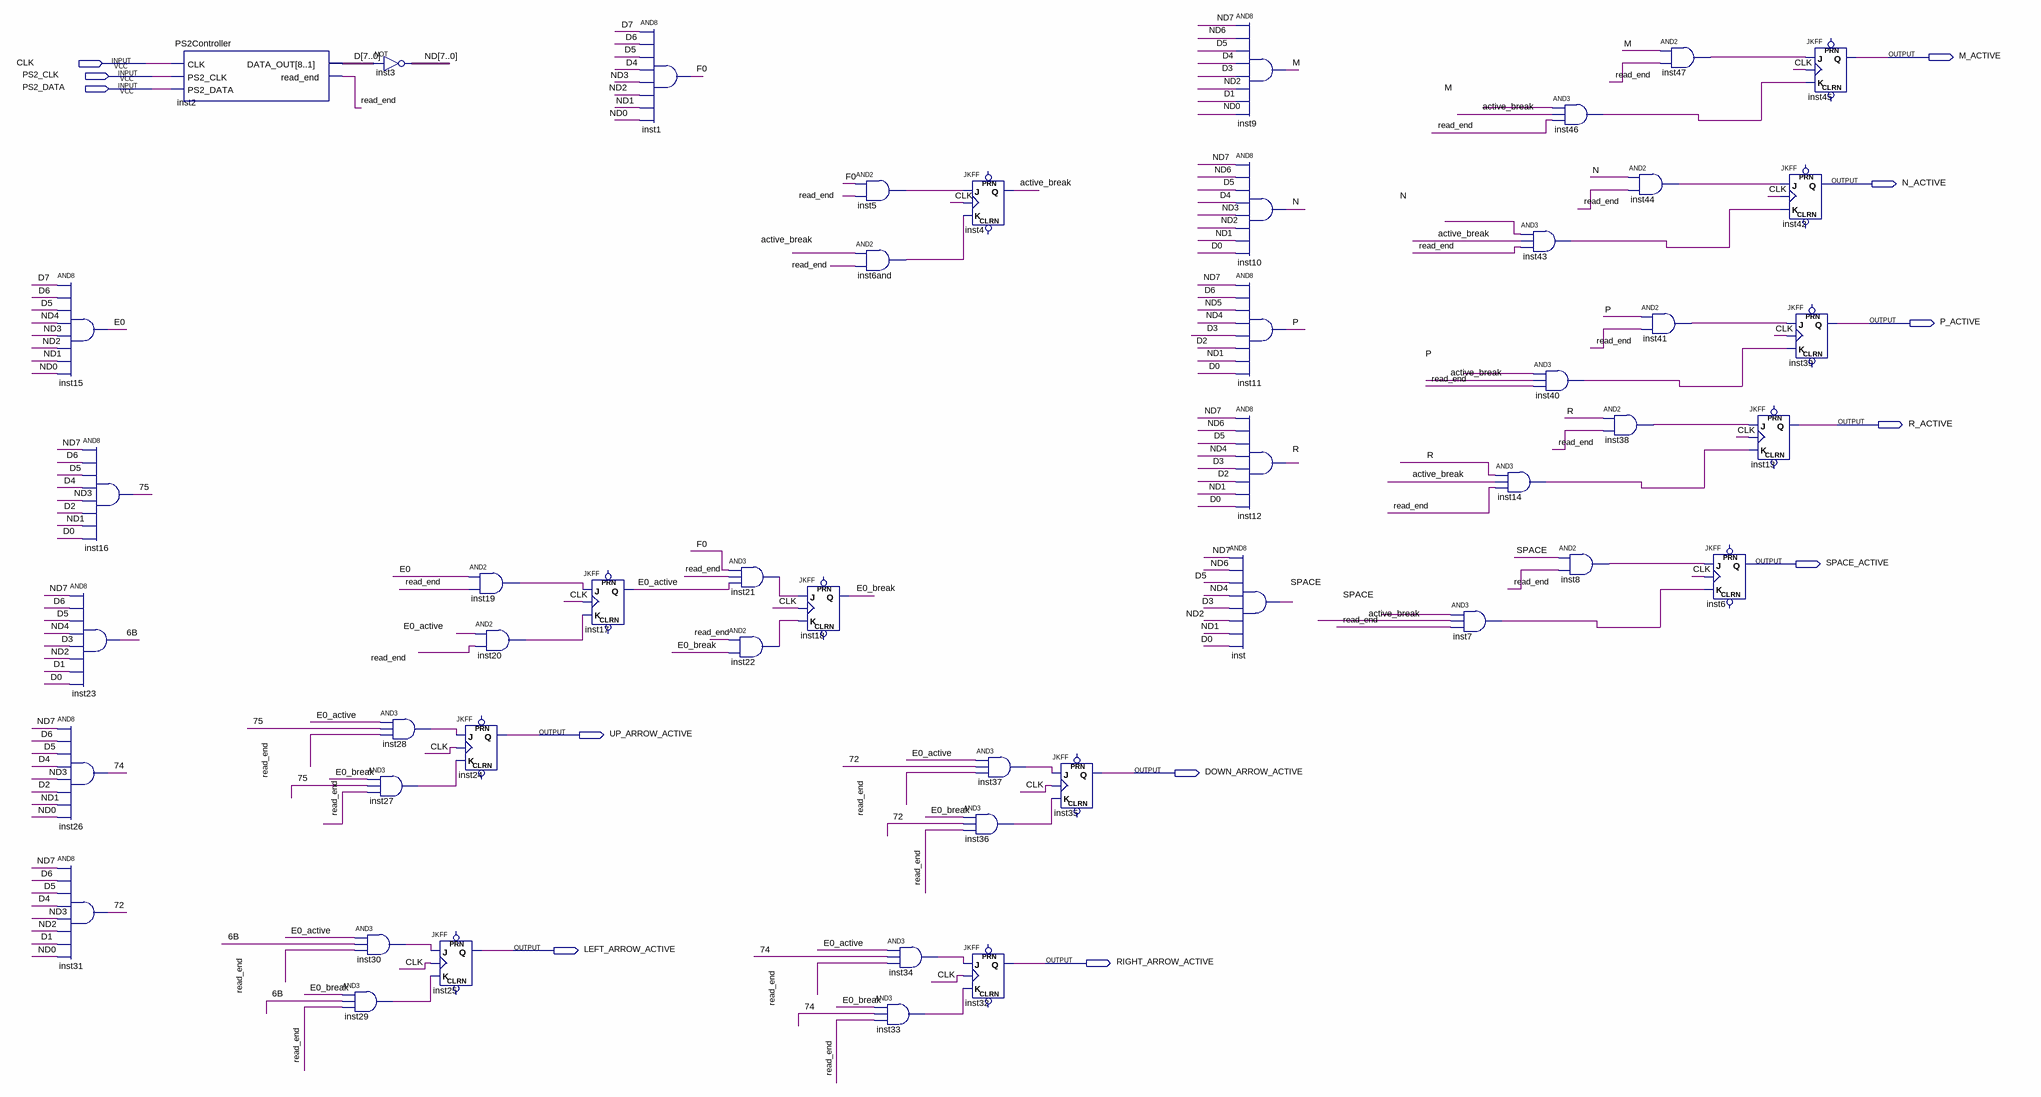
[diagram p0: schematic sheet]
// Quartus schematic KeyDetector.bdf as structural Verilog: 49 symbols, 12 pins
module KeyDetector (
  input  CLK,
  input  PS2_CLK,
  input  PS2_DATA,
  output M_ACTIVE,
  output N_ACTIVE,
  output P_ACTIVE,
  output R_ACTIVE,
  output SPACE_ACTIVE,
  output UP_ARROW_ACTIVE,
  output DOWN_ARROW_ACTIVE,
  output LEFT_ARROW_ACTIVE,
  output RIGHT_ARROW_ACTIVE
);

  wire \6B , \72 , \74 , \75 , active_break, E0, E0_active, E0_break, F0, inst5_out, inst6and_out, inst7_out,
       inst8_out, inst14_out, inst19_out, inst20_out, inst21_out, inst22_out, inst27_out, inst28_out,
       inst29_out, inst30_out, inst33_out, inst34_out, inst36_out, inst37_out, inst38_out, inst40_out,
       inst41_out, inst43_out, inst44_out, inst46_out, inst47_out, M, N, P, R, read_end, SPACE;
  wire [7:0] D, ND;

  and inst15 (E0, D[7], D[6], D[5], ND[4], ND[3], ND[2], ND[1], ND[0]);
  and inst23 (\6B , ND[7], D[6], D[5], ND[4], D[3], ND[2], D[1], D[0]);
  and inst26 (\74 , ND[7], D[6], D[5], D[4], ND[3], D[2], ND[1], ND[0]);
  and inst31 (\72 , ND[7], D[6], D[5], D[4], ND[3], ND[2], D[1], ND[0]);
  and inst16 (\75 , ND[7], D[6], D[5], D[4], ND[3], D[2], ND[1], D[0]);
  PS2Controller inst2 (.CLK(CLK), .PS2_CLK(PS2_CLK), .PS2_DATA(PS2_DATA), .DATA_OUT(D), .read_end(read_end));
  assign ND = ~D;  // NOT inst3, 8 bits wide
  and inst27 (inst27_out, E0_break, \75 , read_end);
  and inst30 (inst30_out, E0_active, \6B , read_end);
  and inst29 (inst29_out, E0_break, \6B , read_end);
  and inst28 (inst28_out, E0_active, \75 , read_end);
  and inst19 (inst19_out, E0, read_end);
  and inst20 (inst20_out, E0_active, read_end);
  JKFF inst24 (.K(inst27_out), .J(inst28_out), .CLK(CLK), .Q(UP_ARROW_ACTIVE));  // open: PRN, CLRN
  JKFF inst25 (.K(inst29_out), .J(inst30_out), .CLK(CLK), .Q(LEFT_ARROW_ACTIVE));  // open: PRN, CLRN
  JKFF inst17 (.K(inst20_out), .J(inst19_out), .CLK(CLK), .Q(E0_active));  // open: PRN, CLRN
  and inst1 (F0, D[7], D[6], D[5], D[4], ND[3], ND[2], ND[1], ND[0]);
  and inst21 (inst21_out, F0, read_end, E0_active);
  and inst22 (inst22_out, read_end, E0_break);
  JKFF inst18 (.K(inst22_out), .J(inst21_out), .CLK(CLK), .Q(E0_break));  // open: PRN, CLRN
  and inst5 (inst5_out, F0, read_end);
  and inst6and (inst6and_out, active_break, read_end);
  and inst33 (inst33_out, E0_break, \74 , read_end);
  and inst34 (inst34_out, E0_active, \74 , read_end);
  JKFF inst4 (.K(inst6and_out), .J(inst5_out), .CLK(CLK), .Q(active_break));  // open: PRN, CLRN
  and inst37 (inst37_out, E0_active, \72 , read_end);
  and inst36 (inst36_out, E0_break, \72 , read_end);
  JKFF inst32 (.K(inst33_out), .J(inst34_out), .CLK(CLK), .Q(RIGHT_ARROW_ACTIVE));  // open: PRN, CLRN
  JKFF inst35 (.K(inst36_out), .J(inst37_out), .CLK(CLK), .Q(DOWN_ARROW_ACTIVE));  // open: PRN, CLRN
  and inst9 (M, ND[7], ND[6], D[5], D[4], D[3], ND[2], D[1], ND[0]);
  and inst10 (N, ND[7], ND[6], D[5], D[4], ND[3], ND[2], ND[1], D[0]);
  and inst11 (P, ND[7], D[6], ND[5], ND[4], D[3], D[2], ND[1], D[0]);
  and inst12 (R, ND[7], ND[6], D[5], ND[4], D[3], D[2], ND[1], D[0]);
  and inst (SPACE, ND[7], ND[6], D[5], ND[4], D[3], ND[2], ND[1], D[0]);
  and inst7 (inst7_out, SPACE, active_break, read_end);
  and inst43 (inst43_out, N, active_break, read_end);
  and inst40 (inst40_out, P, active_break, read_end);
  and inst14 (inst14_out, R, active_break, read_end);
  and inst46 (inst46_out, M, active_break, read_end);
  and inst8 (inst8_out, SPACE, read_end);
  and inst44 (inst44_out, N, read_end);
  and inst41 (inst41_out, P, read_end);
  and inst38 (inst38_out, R, read_end);
  and inst47 (inst47_out, M, read_end);
  JKFF inst6 (.K(inst7_out), .J(inst8_out), .CLK(CLK), .Q(SPACE_ACTIVE));  // open: PRN, CLRN
  JKFF inst42 (.K(inst43_out), .J(inst44_out), .CLK(CLK), .Q(N_ACTIVE));  // open: PRN, CLRN
  JKFF inst39 (.K(inst40_out), .J(inst41_out), .CLK(CLK), .Q(P_ACTIVE));  // open: PRN, CLRN
  JKFF inst13 (.K(inst14_out), .J(inst38_out), .CLK(CLK), .Q(R_ACTIVE));  // open: PRN, CLRN
  JKFF inst45 (.K(inst46_out), .J(inst47_out), .CLK(CLK), .Q(M_ACTIVE));  // open: PRN, CLRN
endmodule
